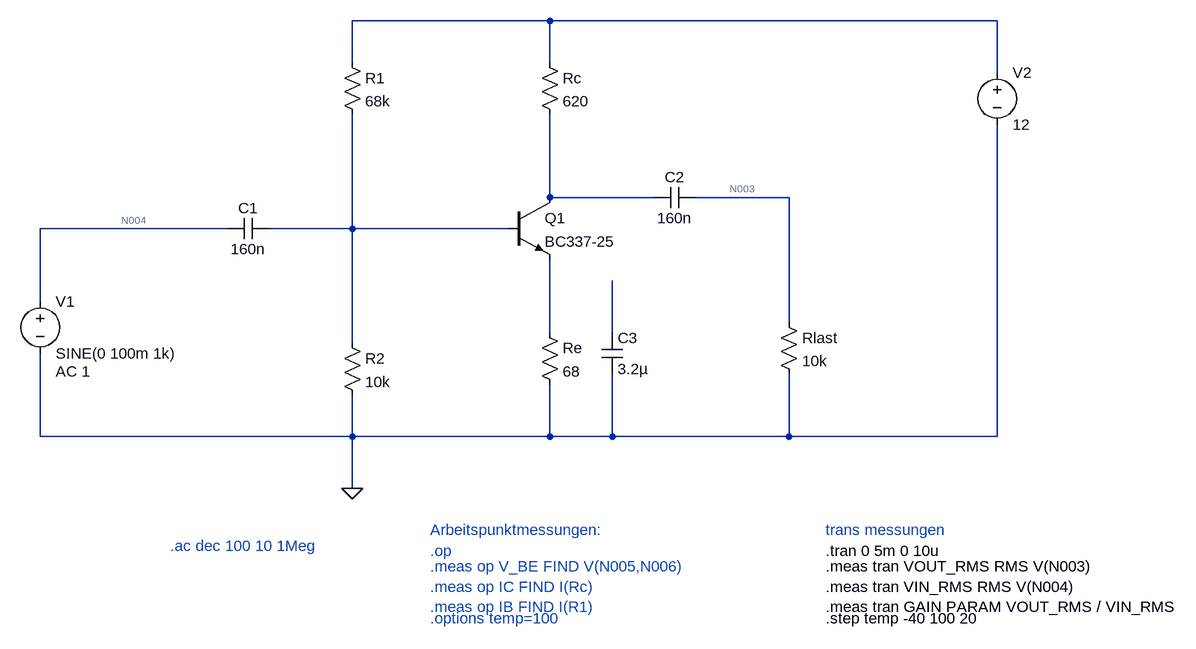
[diagram p0: schematic Emitterverstaercker_mit_ck_BC337.asc]
Emitterverstaercker_mit_ck_BC337.asc, the LTspice schematic file:
Version 4.1
SHEET 1 1160 976
WIRE 176 -160 -128 -160
WIRE 864 -160 176 -160
WIRE -128 -96 -128 -160
WIRE 176 -96 176 -160
WIRE 864 -80 864 -160
WIRE 176 112 176 -16
WIRE 336 112 176 112
WIRE 544 112 400 112
WIRE -320 160 -608 160
WIRE -128 160 -128 -16
WIRE -128 160 -256 160
WIRE 112 160 -128 160
WIRE -608 272 -608 160
WIRE 544 304 544 112
WIRE 176 320 176 208
WIRE 272 320 272 240
WIRE -128 336 -128 160
WIRE -608 480 -608 352
WIRE -128 480 -128 416
WIRE -128 480 -608 480
WIRE 176 480 176 400
WIRE 176 480 -128 480
WIRE 272 480 272 384
WIRE 272 480 176 480
WIRE 544 480 544 384
WIRE 544 480 272 480
WIRE 864 480 864 0
WIRE 864 480 544 480
WIRE -128 560 -128 480
FLAG -128 560 0
DATAFLAG -128 160 ""
DATAFLAG -128 160 ""
DATAFLAG -128 160 ""
DATAFLAG 176 -160 ""
DATAFLAG 176 240 ""
DATAFLAG 176 48 ""
DATAFLAG 272 112 ""
DATAFLAG -128 160 ""
DATAFLAG 464 112 ""
DATAFLAG 352 480 ""
SYMBOL npn 112 112 R0
SYMATTR InstName Q1
SYMATTR Value BC337-25
SYMBOL res -144 -112 R0
SYMATTR InstName R1
SYMATTR Value 68k
SYMBOL res -144 320 R0
SYMATTR InstName R2
SYMATTR Value 10k
SYMBOL res 160 -112 R0
SYMATTR InstName Rc
SYMATTR Value 620
SYMBOL voltage 864 -96 R0
WINDOW 123 0 0 Left 0
WINDOW 39 0 0 Left 0
SYMATTR InstName V2
SYMATTR Value 12
SYMBOL cap -256 144 R90
WINDOW 0 0 32 VBottom 2
WINDOW 3 32 32 VTop 2
SYMATTR InstName C1
SYMATTR Value 160n
SYMBOL cap 400 96 R90
WINDOW 0 0 32 VBottom 2
WINDOW 3 32 32 VTop 2
SYMATTR InstName C2
SYMATTR Value 160n
SYMBOL res 160 304 R0
SYMATTR InstName Re
SYMATTR Value 68
SYMBOL cap 256 320 R0
SYMATTR InstName C3
SYMATTR Value 3.2µ
SYMBOL res 528 288 R0
SYMATTR InstName Rlast
SYMATTR Value 10k
SYMBOL voltage -608 256 R0
WINDOW 123 24 124 Left 2
WINDOW 39 0 0 Left 0
SYMATTR Value2 AC 1
SYMATTR InstName V1
SYMATTR Value SINE(0 100m 1k)
TEXT -8 656 Left 2 ;.op
TEXT -408 648 Left 2 ;.ac dec 100 10 1Meg
TEXT 600 656 Left 2 !.tran 0 5m 0 10u
TEXT -8 624 Left 2 ;Arbeitspunktmessungen:
TEXT -8 680 Left 2 ;.meas op V_BE FIND V(N005,N006)\n.meas op IC FIND I(Rc)\n.meas op IB FIND I(R1)
TEXT 600 624 Left 2 ;trans messungen
TEXT 600 680 Left 2 !.meas tran VOUT_RMS RMS V(N003)\n.meas tran VIN_RMS RMS V(N004)\n.meas tran GAIN PARAM VOUT_RMS / VIN_RMS
TEXT 600 760 Left 2 !.step temp -40 100 20
TEXT -8 760 Left 2 ;.options temp=100

The netlist it stands for:
* Emitterverstaercker_mit_ck_BC337.asc
Q1 N002 N005 N006 0 BC337-25
R1 N001 N005 68k
R2 N005 0 10k
Rc N001 N002 620
V2 N001 0 12
C1 N005 N004 160n
C2 N003 N002 160n
Re N006 0 68
C3 N007 0 3.2µ
Rlast N003 0 10k
V1 N004 0 SINE(0 100m 1k) AC 1
.model NPN NPN
.model PNP PNP
.lib standard.bjt
* .op
* .ac dec 100 10 1Meg
.tran 0 5m 0 10u
* Arbeitspunktmessungen:
* .meas op V_BE FIND V(N005,N006)
* .meas op IC FIND I(Rc)
* .meas op IB FIND I(R1)
* trans messungen
.meas tran VOUT_RMS RMS V(N003)
.meas tran VIN_RMS RMS V(N004)
.meas tran GAIN PARAM VOUT_RMS / VIN_RMS
.step temp -40 100 20
* .options temp=100
.backanno
.end